# Altium project PT-15-V1.0.PrjPcb (part 7 of 7)

## Sheet 17-INTERFACE.SchDoc: KARGOBOT-TBOX-V2.0
size 513 x 386 mm; Page Create Date: March  8, 1995; Page Number: 4; Page Size: C; Page Count: 81; RevCode: A; DsnPath: C:\Users\Administrator\Desktop\123\KARGOBOT-TCU-ORIN-V1.1.DSN; SchematicName: KARGOBT-TCU-ORIN-V1.1; PageName: N100; PageSize: C; TopSchematic: True
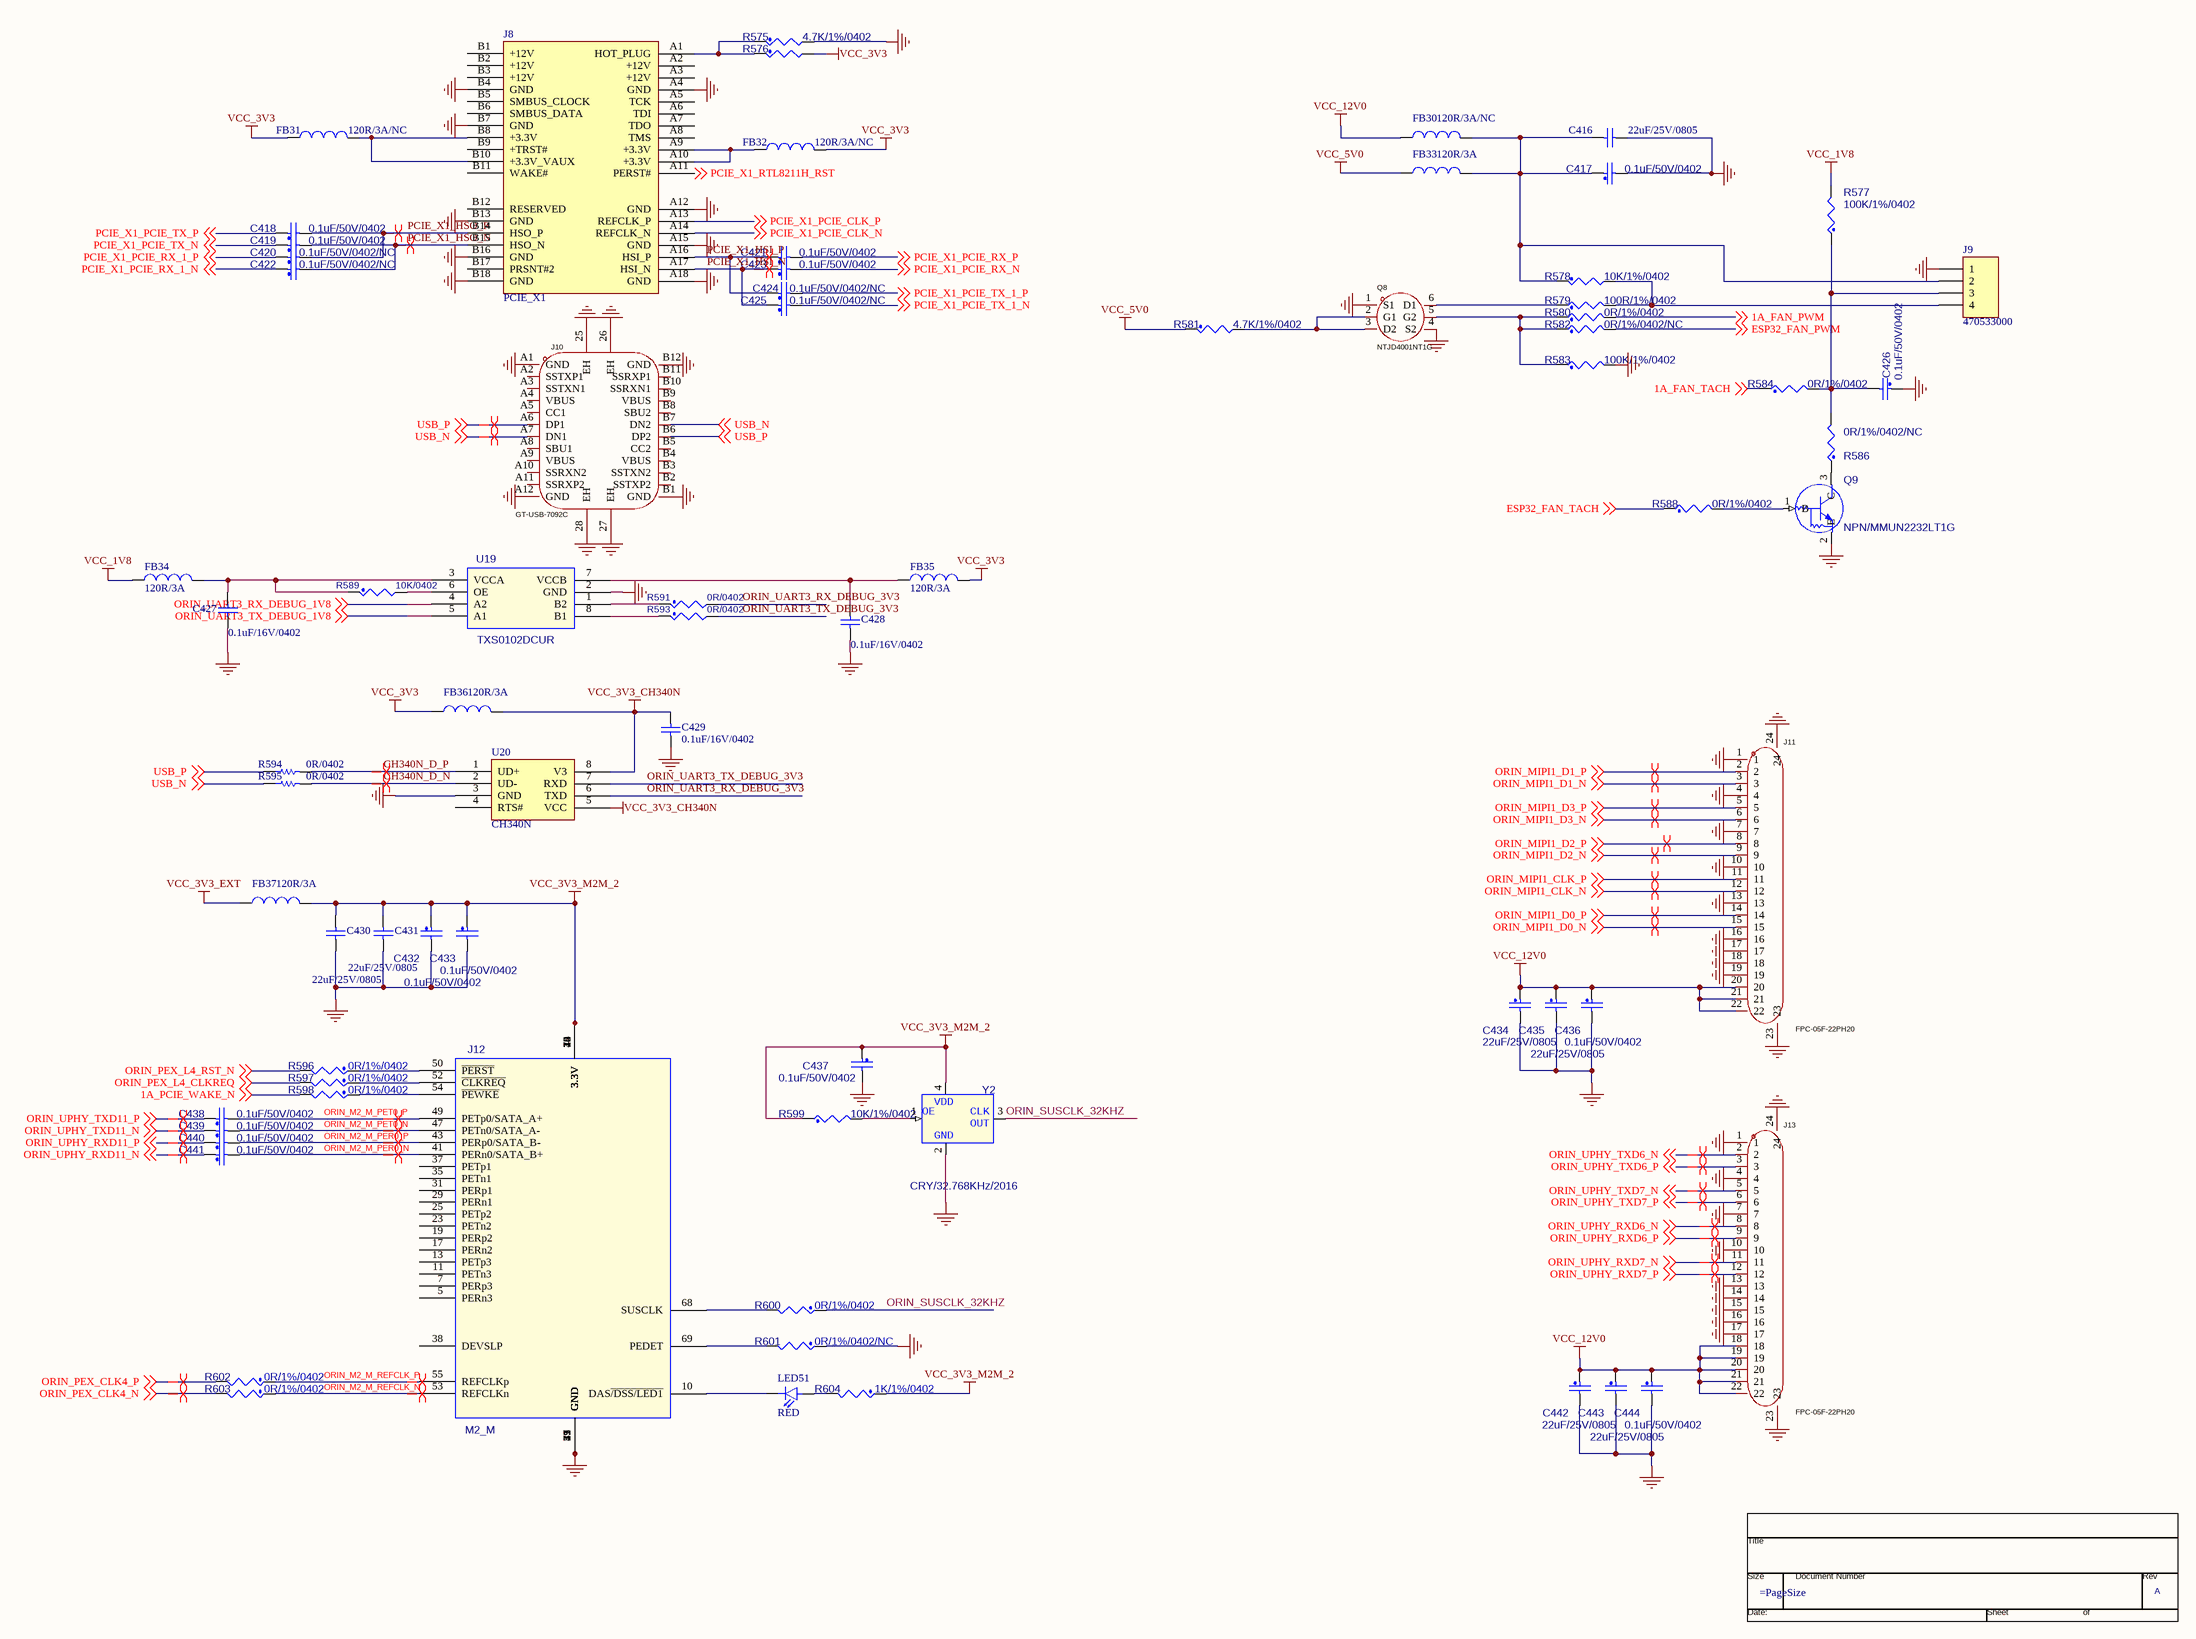
[diagram p27: 17-INTERFACE.SchDoc]

### Parts
(Parts that share a designator on the sheet are numbered #1, #2 ... from top to bottom, then left to right.)
*#12  RevCode: A  (graphical)
C416  22uF/25V/0805  [C0805]
C417  value 0.1uF/50V/0402  [C0402]  (hidden comment: CAP_NP)
C418  value 0.1uF/50V/0402  [C0402]  (hidden comment: CAP_NP)
C419  value 0.1uF/50V/0402  [C0402]  (hidden comment: CAP_NP)
C420  value 0.1uF/50V/0402/NC  [C0402]  (hidden comment: CAP_NP)
C421  value 0.1uF/50V/0402  [C0402]  (hidden comment: CAP_NP)
C422  value 0.1uF/50V/0402/NC  [C0402]  (hidden comment: CAP_NP)
C423  value 0.1uF/50V/0402  [C0402]  (hidden comment: CAP_NP)
C424  value 0.1uF/50V/0402/NC  [C0402]  (hidden comment: CAP_NP)
C425  value 0.1uF/50V/0402/NC  [C0402]  (hidden comment: CAP_NP)
C426  value 0.1uF/50V/0402  [C0402]  (hidden comment: CAP_NP)
C427  0.1uF/16V/0402  [C0402]
C428  0.1uF/16V/0402  [C0402]
C429  0.1uF/16V/0402  [C0402]
C430  22uF/25V/0805  [C0805]
C431  22uF/25V/0805  [C0805]
C432  value 0.1uF/50V/0402  [C0402]  (hidden comment: CAP_NP)
C433  value 0.1uF/50V/0402  [C0402]  (hidden comment: CAP_NP)
C434  value 22uF/25V/0805  [C0805]  (hidden comment: CAP_NP)
C435  value 22uF/25V/0805  [C0805]  (hidden comment: CAP_NP)
C436  value 0.1uF/50V/0402  [C0402]  (hidden comment: CAP_NP)
C437  0.1uF/50V/0402  [C0402]
C438  value 0.1uF/50V/0402  [C0402]  (hidden comment: CAP_NP)
C439  value 0.1uF/50V/0402  [C0402]  (hidden comment: CAP_NP)
C440  value 0.1uF/50V/0402  [C0402]  (hidden comment: CAP_NP)
C441  value 0.1uF/50V/0402  [C0402]  (hidden comment: CAP_NP)
C442  value 22uF/25V/0805  [C0805]  (hidden comment: CAP_NP)
C443  value 22uF/25V/0805  [C0805]  (hidden comment: CAP_NP)
C444  value 0.1uF/50V/0402  [C0402]  (hidden comment: CAP_NP)
FB30  120R/3A/NC  [L0603]
FB31  120R/3A/NC  [L0603]
FB32  120R/3A/NC  [L0603]
FB33  120R/3A  [L0603]
FB34  120R/3A  [L0603]
FB35  120R/3A  [L0603]
FB36  120R/3A  [L0603]
FB37  120R/3A  [L0603]
J8  PCIE_X1  [PCIeX16-GF-2D-1000-1K-O36]
J9  470533000  [470533000]
J10  GT-USB-7092C  [USB-C-SMD_GT-USB-7092C]
J11  FPC-05F-22PH20  [FPC-SMD_22P-P0.50_FPC-05F-22PH20]
J12  M2_M  [PCIe_M.2_Connectors_P=0.5mm_H=4.2mm_KeyM - 1]
J13  FPC-05F-22PH20  [FPC-SMD_22P-P0.50_FPC-05F-22PH20]
LED51  RED  [LED0603]
Q8  NTJD4001NT1G  [SOT-363_L2.0-W1.3-P0.65-LS2.1-TL]
Q9  NPN/MMUN2232LT1G  [SOT-23]
R575  value 4.7K/1%/0402  [R0402]  (hidden comment: RES_Dup2)
R576  RES_Dup2  [R0402]  (value not drawn)
R577  value 100K/1%/0402  [R0402]  (hidden comment: RES_Dup2)
R578  value 10K/1%/0402  [R0402]  (hidden comment: RES_Dup2)
R579  value 100R/1%/0402  [R0402]  (hidden comment: RES_Dup2)
R580  value 0R/1%/0402  [R0402]  (hidden comment: RES_Dup2)
R581  value 4.7K/1%/0402  [R0402]  (hidden comment: RES_Dup2)
R582  value 0R/1%/0402/NC  [R0402]  (hidden comment: RES_Dup2)
R583  value 100K/1%/0402  [R0402]  (hidden comment: RES_Dup2)
R584  value 0R/1%/0402  [R0402]  (hidden comment: RES_Dup2)
R586  value 0R/1%/0402/NC  [R0402]  (hidden comment: RES_Dup2)
R588  value 0R/1%/0402  [R0402]  (hidden comment: RES_Dup2)
R589  10K/0402  [R0402]
R591  0R/0402  [R0402]
R593  0R/0402  [R0402]
R594  0R/0402  [R0402]
R595  0R/0402  [R0402]
R596  value 0R/1%/0402  [R0402]  (hidden comment: RES_Dup2)
R597  value 0R/1%/0402  [R0402]  (hidden comment: RES_Dup2)
R598  value 0R/1%/0402  [R0402]  (hidden comment: RES_Dup2)
R599  10K/1%/0402  [R0402]
R600  value 0R/1%/0402  [R0402]  (hidden comment: RES_Dup2)
R601  value 0R/1%/0402/NC  [R0402]  (hidden comment: RES_Dup2)
R602  value 0R/1%/0402  [R0402]  (hidden comment: RES_Dup2)
R603  value 0R/1%/0402  [R0402]  (hidden comment: RES_Dup2)
R604  value 1K/1%/0402  [R0402]  (hidden comment: RES_Dup2)
U19  TXS0102DCUR  [VSSOP-8-TXS0102DCUR]
U20  CH340N  [SOP-8_L4.9-W3.9-P1.27-LS6.0-BL]
Y2  CRY/32.768KHz/2016  [CRY2016]

### Nets
GND: C416.1 C417.2 C426.1 C427.1 C428.1 C429.1 C430.1 C431.1 C432.2 C433.2 C434.2 C435.2 C436.2 C437.2 C442.2 C443.2 C444.2 J8.A4(GND) J8.A12(GND) J8.A15(GND) J8.A18(GND) J8.B4(GND) J8.B7(GND) J8.B13(GND) J8.B16(GND) J8.B18(GND) J9.1 J10.25(EH) J10.26(EH) J10.27(EH) J10.28(EH) J10.A1(GND) J10.A12(GND) J10.B1(GND) J10.B12(GND) J11.1 J11.4 J11.7 J11.10 J11.13 J11.16 J11.17 J11.18 J11.19 J11.23 J11.24 J12.1(GND) J12.3(GND) J12.9(GND) J12.15(GND) J12.21(GND) J12.27(GND) J12.33(GND) J12.39(GND) J12.45(GND) J12.51(GND) J12.57(GND) J12.71(GND) J12.73(GND) J12.75(GND) J13.1 J13.4 J13.7 J13.10 J13.13 J13.14 J13.15 J13.16 J13.17 J13.23 J13.24 Q8.1(S1) Q8.4(S2) Q9.2(E) R575.2 R583.2 R601.1 U19.2(GND) U20.3(GND) Y2.2(GND)
VCC_1V8: FB34.1 R577.2  [project net 1V8_ORIN_F1]
VCC_3V3: FB31.1 FB32.2 FB35.2 FB36.1 R576.2  [project net 3V3_ORIN_F1]
VCC_3V3_CH340N: C429.2 FB36.2 U20.5(VCC) U20.8(V3)
VCC_3V3_EXT: FB37.1
VCC_3V3_M2M_2: C430.2 C431.2 C432.1 C433.1 C437.1 FB37.2 J12.2(3.3V) J12.4(3.3V) J12.12(3.3V) J12.14(3.3V) J12.16(3.3V) J12.18(3.3V) J12.70(3.3V) J12.72(3.3V) J12.74(3.3V) R599.1 R604.1 Y2.4(VDD)
VCC_5V0: FB33.1 R581.1
VCC_12V0: C434.1 C435.1 C436.1 C442.1 C443.1 C444.1 FB30.1 J11.20 J11.21 J11.22 J13.18 J13.19 J13.20 J13.21 J13.22
1A_FAN_PWM: R580.2 ; off-sheet 1A_FAN_PWM  [project net FAN_PWM]
1A_FAN_TACH: R584.1 ; off-sheet 1A_FAN_TACH  [project net FAN_TACH]
1A_PCIE_WAKE_N: R598.2 ; off-sheet 1A_PCIE_WAKE_N  [project net PEX_WAKE_N]
CH340N_D_N: R595.2 U20.2(UD-)
CH340N_D_P: R594.2 U20.1(UD+)
ESP32_FAN_PWM: R582.2 ; off-sheet ESP32_FAN_PWM
ESP32_FAN_TACH: R588.1 ; off-sheet ESP32_FAN_TACH
ORIN_M2_M_PER0_N: C441.2 J12.41(PERn0/SATA_B+)
ORIN_M2_M_PER0_P: C440.2 J12.43(PERp0/SATA_B-)
ORIN_M2_M_PET0_N: C439.2 J12.47(PETn0/SATA_A-)
ORIN_M2_M_PET0_P: C438.2 J12.49(PETp0/SATA_A+)
ORIN_M2_M_REFCLK_N: J12.53(REFCLKn) R603.1
ORIN_M2_M_REFCLK_P: J12.55(REFCLKp) R602.1
ORIN_MIPI1_CLK_N: J11.12 ; off-sheet ORIN_MIPI1_CLK_N  [project net CSI_0_CLK_N]
ORIN_MIPI1_CLK_P: J11.11 ; off-sheet ORIN_MIPI1_CLK_P  [project net CSI_0_CLK_P]
ORIN_MIPI1_D0_N: J11.15 ; off-sheet ORIN_MIPI1_D0_N  [project net CSI_0_D0_N]
ORIN_MIPI1_D0_P: J11.14 ; off-sheet ORIN_MIPI1_D0_P  [project net CSI_0_D0_P]
ORIN_MIPI1_D1_N: J11.3 ; off-sheet ORIN_MIPI1_D1_N  [project net CSI_0_D1_N]
ORIN_MIPI1_D1_P: J11.2 ; off-sheet ORIN_MIPI1_D1_P  [project net CSI_0_D1_P]
ORIN_MIPI1_D2_N: J11.9 ; off-sheet ORIN_MIPI1_D2_N  [project net CSI_1_D0_N]
ORIN_MIPI1_D2_P: J11.8 ; off-sheet ORIN_MIPI1_D2_P  [project net CSI_1_D0_P]
ORIN_MIPI1_D3_N: J11.6 ; off-sheet ORIN_MIPI1_D3_N  [project net CSI_1_D1_N]
ORIN_MIPI1_D3_P: J11.5 ; off-sheet ORIN_MIPI1_D3_P  [project net CSI_1_D1_P]
ORIN_PEX_CLK4_N: R603.2 ; off-sheet ORIN_PEX_CLK4_N
ORIN_PEX_CLK4_P: R602.2 ; off-sheet ORIN_PEX_CLK4_P
ORIN_PEX_L4_CLKREQ: R597.2 ; off-sheet ORIN_PEX_L4_CLKREQ  [project net SNN_PEX_L4_CLKREQ_N]
ORIN_PEX_L4_RST_N: R596.2 ; off-sheet ORIN_PEX_L4_RST_N  [project net SNN_PEX_L4_RST_N]
ORIN_SUSCLK_32KHZ: R600.1 Y2.3(CLKOUT)
ORIN_UART3_RX_DEBUG_1V8: U19.4(A2) ; off-sheet ORIN_UART3_RX_DEBUG_1V8  [project net UART3_RX_DEBUG]
ORIN_UART3_RX_DEBUG_3V3: R591.2 U20.6(TXD)
ORIN_UART3_TX_DEBUG_1V8: U19.5(A1) ; off-sheet ORIN_UART3_TX_DEBUG_1V8  [project net UART3_TX_DEBUG]
ORIN_UART3_TX_DEBUG_3V3: R593.2 U20.7(RXD)
ORIN_UPHY_RXD6_N: J13.8 ; off-sheet ORIN_UPHY_RXD6_N  [project net UPHY_RX6_N]
ORIN_UPHY_RXD6_P: J13.9 ; off-sheet ORIN_UPHY_RXD6_P  [project net UPHY_RX6_P]
ORIN_UPHY_RXD7_N: J13.11 ; off-sheet ORIN_UPHY_RXD7_N  [project net UPHY_RX7_N]
ORIN_UPHY_RXD7_P: J13.12 ; off-sheet ORIN_UPHY_RXD7_P  [project net UPHY_RX7_P]
ORIN_UPHY_RXD11_N: C441.1 ; off-sheet ORIN_UPHY_RXD11_N  [project net UPHY_RX11_N]
ORIN_UPHY_RXD11_P: C440.1 ; off-sheet ORIN_UPHY_RXD11_P  [project net UPHY_RX11_P]
ORIN_UPHY_TXD6_N: J13.2 ; off-sheet ORIN_UPHY_TXD6_N
ORIN_UPHY_TXD6_P: J13.3 ; off-sheet ORIN_UPHY_TXD6_P
ORIN_UPHY_TXD7_N: J13.5 ; off-sheet ORIN_UPHY_TXD7_N
ORIN_UPHY_TXD7_P: J13.6 ; off-sheet ORIN_UPHY_TXD7_P
ORIN_UPHY_TXD11_N: C439.1 ; off-sheet ORIN_UPHY_TXD11_N  [project net UPHY_TX11_N]
ORIN_UPHY_TXD11_P: C438.1 ; off-sheet ORIN_UPHY_TXD11_P  [project net UPHY_TX11_P]
PCIE_X1_HSI_N: C423.1 C425.1 J8.A17(HSI_N)
PCIE_X1_HSI_P: C421.1 C424.1 J8.A16(HSI_P)
PCIE_X1_HSO_N: C419.2 C422.2 J8.B15(HSO_N)
PCIE_X1_HSO_P: C418.2 C420.2 J8.B14(HSO_P)
PCIE_X1_PCIE_CLK_N: J8.A14(REFCLK_N) ; off-sheet PCIE_X1_PCIE_CLK_N
PCIE_X1_PCIE_CLK_P: J8.A13(REFCLK_P) ; off-sheet PCIE_X1_PCIE_CLK_P
PCIE_X1_PCIE_RX_1_N: C422.1 ; off-sheet PCIE_X1_PCIE_RX_1_N
PCIE_X1_PCIE_RX_1_P: C420.1 ; off-sheet PCIE_X1_PCIE_RX_1_P
PCIE_X1_PCIE_RX_N: C423.2 ; off-sheet PCIE_X1_PCIE_RX_N
PCIE_X1_PCIE_RX_P: C421.2 ; off-sheet PCIE_X1_PCIE_RX_P
PCIE_X1_PCIE_TX_1_N: C425.2 ; off-sheet PCIE_X1_PCIE_TX_1_N
PCIE_X1_PCIE_TX_1_P: C424.2 ; off-sheet PCIE_X1_PCIE_TX_1_P
PCIE_X1_PCIE_TX_N: C419.1 ; off-sheet PCIE_X1_PCIE_TX_N
PCIE_X1_PCIE_TX_P: C418.1 ; off-sheet PCIE_X1_PCIE_TX_P
PCIE_X1_RTL8211H_RST: J8.A11(PERST#) ; off-sheet PCIE_X1_RTL8211H_RST
USB_N: J10.A7(DN1) J10.B7(DN2) R595.1 ; off-sheet USB_N
USB_P: J10.A6(DP1) J10.B6(DP2) R594.1 ; off-sheet USB_P
NetC416_2: C416.2 C417.1 FB30.2 FB33.2 J9.2 R578.1
NetC426_2: C426.2 J9.3 R577.1 R584.2 R586.2
NetC427_2: C427.2 FB34.2 R589.1 U19.3(VCCA)
NetC428_2: C428.2 FB35.1 U19.7(VCCB)
NetFB31_2: FB31.2 J8.B8(+3.3V) J8.B10(+3.3V_VAUX)
NetFB32_1: FB32.1 J8.A9(+3.3V) J8.A10(+3.3V)
NetJ8_A1: J8.A1(HOT_PLUG) R575.1 R576.1
NetJ9_4: J9.4 R578.2 R579.2
NetJ12_10: J12.10(DAS~{/DSS/LED1}) LED51.2
NetJ12_50: J12.50(~{PERST}) R596.1
NetJ12_52: J12.52(~{CLKREQ}) R597.1
NetJ12_54: J12.54(~{PEWKE}) R598.1
NetJ12_68: J12.68(SUSCLK) R600.2
NetJ12_69: J12.69(PEDET) R601.2
NetLED51_1: LED51.1 R604.2
NetQ8_2: Q8.2(G1) Q8.3(D2) R581.2
NetQ8_5: Q8.5(G2) R580.1 R582.1 R583.1
NetQ8_6: Q8.6(D1) R579.1
NetQ9_1: Q9.1(B) R588.2
NetQ9_3: Q9.3(C) R586.1
NetR589_2: R589.2 U19.6(OE)
NetR591_1: R591.1 U19.1(B2)
NetR593_1: R593.1 U19.8(B1)
NetR599_2: R599.2 Y2.1(OE)

Not connected (* = marked no-connect by the designer): J8 A2(+12V) A3(+12V) A5(TCK) A6(TDI) A7(TDO) A8(TMS) B1(+12V) B2(+12V) B3(+12V) B5(SMBUS_CLOCK) B6(SMBUS_DATA) B9(+TRST#) B11(WAKE#) B12(RESERVED) B17(PRSNT#2); J10 A2(SSTXP1) A3(SSTXN1) A4(VBUS) A5(CC1) A8(SBU1) A9(VBUS) A10(SSRXN2) A11(SSRXP2) B2(SSTXP2) B3(SSTXN2) B4(VBUS) B5(CC2) B8(SBU2) B9(VBUS) B10(SSRXN1) B11(SSRXP1); J12 5(PERn3) 7(PERp3) 11(PETn3) 13(PETp3) 17(PERn2) 19(PERp2) 23(PETn2) 25(PETp2) 29(PERn1) 31(PERp1) 35(PETn1) 37(PETp1) 38(DEVSLP); U20 4(RTS#)

### Layout directives
differential pair: CH340N_D_N, CH340N_D_P, CSI_0_CLK_N, CSI_0_CLK_P, CSI_0_D0_N, CSI_0_D0_P, CSI_0_D1_N, CSI_0_D1_P, CSI_1_D0_N, CSI_1_D0_P, CSI_1_D1_N, CSI_1_D1_P, ORIN_M2_M_PER0_N, ORIN_M2_M_PER0_P, ORIN_M2_M_PET0_N, ORIN_M2_M_PET0_P, ORIN_M2_M_REFCLK_N, ORIN_M2_M_REFCLK_P, ORIN_PEX_CLK4_N, ORIN_PEX_CLK4_P, ORIN_UPHY_TXD6_N, ORIN_UPHY_TXD6_P, ORIN_UPHY_TXD7_N, ORIN_UPHY_TXD7_P, PCIE_X1_HSI_N, PCIE_X1_HSI_P, PCIE_X1_HSO_N, PCIE_X1_HSO_P, UPHY_RX6_N, UPHY_RX6_P, UPHY_RX7_N, UPHY_RX7_P, UPHY_RX11_N, UPHY_RX11_P, UPHY_TX11_N, UPHY_TX11_P, USB_N, USB_P

### Notes on the sheet
- (in symbol CLKGEN-SM) CLK; OUT
- (in symbol TitleBlock0) Title; Size; Document Number; Rev; Date:; Sheet; of

### Library data of the parts
*#12 = TitleBlock0: Page Count: 81; Page Number: 4; Title: KARGOBOT-TBOX-V2.0; Page Size: =PageSize; Page Create Date: March  8, 1995; Page Modify Date: =ModifiedDate
C416 C427-C431 = CAP: Capacitor; Value: 100pF; Published: 8-Jun-2000; Revision: July-2002: Re-released for DXP Platform.; Publisher: Altium Limited
C417-C426 C432 C433 C436 C438-C441 C444 = CAP_NP: GCM155R71H104KE02/MURATA; Part Reference: C15; CLASS: DISCRETE; FPLIST: CC0402_25,CC0402_HD,CC0402_CC; CAD_APPROVED: Yes; MFG_PN01: 0402YC104KAT2A; MFG_NAME01: AVX; Tolerance: 10%; AGILE_PN: 150-75182; VOLTAGE: 16V; HEIGHT: 0.635MM; ROHS: Yes; TOL: 10%; PCB Footprint: C0402
C434 C435 C442 C443 = CAP_NP: GRT31CC71E226ME13/MURATA; Part Reference: C13; CLASS: DISCRETE; VOLTAGE: 10v; CAD_APPROVED: Yes; MFG_PN01: C1608X5R1A106K; MFG_NAME01: TDK; TOL: 10%; AGILE_PN: 150-78675; FPLIST: CC0603_OV,CC0603,0603_CC; PCB Footprint: C1206; HEIGHT: 1.016MM; ROHS: Yes; Tolerance: 10%
C437 = CAP_NP_Dup1: GCM155R71H104KE02/MURATA; Part Reference: C38; CLASS: DISCRETE; Value: 0.1uF/50V/0402; PCB Footprint: C0402
FB30-FB37 = Inductor: BLM18KG121TN1D; Code_IEC: 1005; Value: 10mH; Published: 8-Jun-2000; LatestRevisionDate: 29-May-2009; LatestRevisionNote: IPC-7351 Footprint Added.; PackageReference: 0402-A; Publisher: Altium Limited; PackageDescription: Chip Inductor; Code_JEITA: 0402
J9 = Header 4: Header, 4-Pin; LatestRevisionDate: 17-Jul-2002; LatestRevisionNote: Re-released for DXP Platform.; Publisher: Altium Limited
J10 = GT-USB-7092C: Manufacturer: G-Switch(品赞); Add into BOM: yes; Connector Type: Type-C; Gender: 母; Number of Contacts: 24P; Number of Ports: 1; Current Rating - Power (Max): 5A; Rated Voltage (Max): 24V; Connect-Disconnect Life: 1万次; Center Height: 7.2mm; Core Colour: 黑色; Symbol: GT-USB-7092C; Device: GT-USB-7092C; LCSC Part Name: Type-C 母 侧贴; Supplier Part: C22471968; Manufacturer Part: GT-USB-7092C; Supplier Footprint: SMD; JLCPCB Part Class: Extended Part; Datasheet: https://atta.szlcsc.com/upload/public/pdf/source/20240624/0752ADA6134B10077FCDD9A2DA872EFC.pdf; Supplier: LCSC; Convert to PCB: yes; Standard: USB 3.1; Mounting Style: 侧贴; Length: 13.9mm; Operating Temperature Range: -40℃~+85℃; Comment_1: GT-USB-7092C
J11 J13 = FPC-05F-22PH20: Manufacturer: XUNPU(讯普); Add into BOM: yes; Locking Feature: 翻盖式; Number of Contacts: 22P; Pitch: 0.5mm; FFC, FCB Thickness: 0.3mm; Symbol: FPC-05F-22PH20; Device: FPC-05F-22PH20; LCSC Part Name: 间距:0.5mm P数:22P 翻盖式 下接; Supplier Part: C2856804; Manufacturer Part: FPC-05F-22PH20; Supplier Footprint: SMD,P=0.5mm,卧贴; JLCPCB Part Class: Extended Part; Datasheet: https://atta.szlcsc.com/upload/public/pdf/source/20210922/C2856804_675295370E4BEA18823604D875A4450B.pdf; Supplier: LCSC; Convert to PCB: yes; Contact Type: 下接; Mounting Type: 卧贴; Height Above Board: 2mm; Operating Temperature Range: -25℃~+85℃; Comment_1: FPC-05F-22PH20
J12 = M2_M: Part Reference: J2; PCB Footprint: M2_M; Value: M2_M
LED51 = LED
Q8 = NTJD4001NT1G: Manufacturer: onsemi(安森美); Add into BOM: yes; Type: 2个N沟道; Drain Source Voltage (Vdss): 30V; Continuous Drain Current (Id): 250mA; Drain Source On Resistance (RDS(on)@Vgs,Id): 1Ω@4.0V,10mA; Power Dissipation (Pd): 272mW; Gate Threshold Voltage (Vgs(th)@Id): 1.2V@100uA; Total Gate Charge (Qg@Vgs): 1.3nC@5.0V; Input Capacitance (Ciss@Vds): 33pF; Reverse Transfer Capacitance (Crss@Vds): 12pF; Symbol: NTJD4001NT1G; Device: NTJD4001NT1G; LCSC Part Name: 2个N沟道 耐压:30V 电流:250mA; Supplier Part: C190019; Manufacturer Part: NTJD4001NT1G; Supplier Footprint: SOT-363; JLCPCB Part Class: Extended Part; Datasheet: https://atta.szlcsc.com/upload/public/pdf/source/20221020/BF1533DEA35874F4C3E9C060B4E2CFE5.pdf; Supplier: LCSC; Convert to PCB: yes; Operating Temperature: -55℃~+150℃; Comment_1: NTJD4001NT1G
Q9 = DTC143ZE: MMUN2232LT1G/ONSEMI; Part Reference: Q1; Value: NPN/MMUN2232LT1G; PCB Footprint: SOT-23
R575 R576 R578 R581 = RES_Dup2: AC0402FR-074K7L/YAGEO; Part Reference: R7982; CLASS: DISCRETE; TOL: 5%; AGILE_PN: 470-75626; MFG_NAME01: KOA SPEER; MFG_PN01: RK73B1ETTP472J; CAD_APPROVED: Yes; FPLIST: RC0402_25,RC0402_HD,RC0402_CC; HEIGHT: 0.41mm; Tolerance: 5%; ROHS: Yes; PCB Footprint: R0402
R577 R579 R580 R582-R584 R586 R588 = RES_Dup2: AC0402FR-070RL/YAGEO; Part Reference: R179; CLASS: DISCRETE; SIGNAL_MODEL: DEFAULT_RESISTOR_33.000000OHM_2_1; FPLIST: RC0603_OV; CAD_APPROVED: Yes; MFG_PN01: CR-02FL6---33R; MFG_NAME01: YAGEO; Tolerance: 1%; AGILE_PN: 470-75790; TOL: 5%; ROHS: Yes; HEIGHT: 0.4MM; PCB Footprint: R0402
R589 R591 R593 = RES_Dup1: RES MF 1.0K 1/16W 5% 0402; CLASS: DISCRETE; AGILE_PN: 470-75555; MFG_NAME01: VISHAY INTERTECHNOLOGY; MFG_PN01: CRCW04021K00JNED; CAD_APPROVED: Yes; FPLIST: RC0402_25,RC0402_HD,RC0402_CC; HEIGHT: 0.41mm; TOL: 5%; Tolerance: 5%; ROHS: Yes
R594 R595 = Res Semi: Semiconductor Resistor; Value: 240R; Published: 8-Jun-2000; LatestRevisionDate: 17-Jul-2002; LatestRevisionNote: Re-released for DXP Platform.; PackageReference: AXIAL-0.5; Publisher: Altium Limited; PackageDescription: Axial Device, Thru-Hole; 2 Leads; 0.5 in Pin Spacing
R596-R598 R600-R604 = RES_Dup2: AC0402FR-070RL/YAGEO; Part Reference: R97; CLASS: DISCRETE; SIGNAL_MODEL: DEFAULT_RESISTOR_33.000000OHM_2_1; FPLIST: RC0603_OV; CAD_APPROVED: Yes; MFG_PN01: CR-02FL6---33R; MFG_NAME01: YAGEO; Tolerance: 1%; AGILE_PN: 470-75790; TOL: 5%; ROHS: Yes; HEIGHT: 0.4MM; PCB Footprint: R0402
R599 = RES_0: AC0402FR-0710KL/YAGEO; Part Reference: R55; CLASS: DISCRETE; Value: 10K/1%/0402; PCB Footprint: R0402
U19 = TXS0102DCUR: TXS0102DCUR/TI; Part Reference: U12; PCB Footprint: VSSOP8-TXS0102DCUR; Value: TXS0102DCUR
Y2 = CLKGEN-SM: SX1M32.768KM10F30TNN/SCTF; Part Reference: Y1; CLASS: IC; Value: CRY/32.768KHz/2016; PCB Footprint: CRY2016

## Nets that join several sheets
1V8_ORIN_F1: 01-ORIN_PWR (R1.2), 02-ORIN_LOW_SPEED_SIGNAL (29 pins), 03-ORIN_HIGH_SPEED_SIGNAL_1 (R129.2 R130.2), 04-ORIN_HIGH_SPEED_SIGNAL_2 (14 pins), 05_RTL8211F (L4.1), 16-PWR_2 (FB21.2 FB22.2), 17-INTERFACE (FB34.1 R577.2)
3V3_ORIN_F1: 02-ORIN_LOW_SPEED_SIGNAL (R114.2), 03-ORIN_HIGH_SPEED_SIGNAL_1 (FB1.1), 04-ORIN_HIGH_SPEED_SIGNAL_2 (6 pins), 05_RTL8211F (9 pins), 06-RTL8111H-1 (FB4.1), 07-N100 (5 pins), 09-RTL8111H-2 (FB9.1), 10-ESP32 (FB10.1 FB11.2 FB13.1 R308.1), 12-RTL8111H-3 (FB14.1), 13-AX88179A (L7.1), 14-RTL8367 (FB16.1), 16-PWR_2 (FB17.2 FB18.2 R553.1), 17-INTERFACE (5 pins)
GND: 01-ORIN_PWR (285 pins), 02-ORIN_LOW_SPEED_SIGNAL (8 pins), 03-ORIN_HIGH_SPEED_SIGNAL_1 (C40.2 C41.2 J16.2), 04-ORIN_HIGH_SPEED_SIGNAL_2 (11 pins), 05_RTL8211F (26 pins), 06-RTL8111H-1 (16 pins), 07-N100 (80 pins), 08-M2_E&M_KEY (36 pins), 09-RTL8111H-2 (16 pins), 10-ESP32 (61 pins), 11-LED (53 pins), 12-RTL8111H-3 (16 pins), 13-AX88179A (47 pins), 14-RTL8367 (71 pins), 15-PWR_1 (91 pins), 16-PWR_2 (71 pins), 17-INTERFACE (80 pins)
VCC_3V3_EXT: 08-M2_E&M_KEY (FB7.1 FB8.1), 16-PWR_2 (FB19.2 FB20.2 R559.1), 17-INTERFACE (FB37.1)
VCC_3V3_LED: 11-LED (53 pins), 16-PWR_2 (FB23.2 FB24.2 R570.1)
VCC_5V0: 01-ORIN_PWR (17 pins), 13-AX88179A (FB38.1), 15-PWR_1 (8 pins), 16-PWR_2 (18 pins), 17-INTERFACE (FB33.1 R581.1)
VCC_12V0: 01-ORIN_PWR (62 pins), 07-N100 (16 pins), 15-PWR_1 (8 pins), 17-INTERFACE (15 pins)
VCCIN: 15-PWR_1 (27 pins), 16-PWR_2 (6 pins)
VCCIN_12V: 10-ESP32 (R630.2), 15-PWR_1 (7 pins)
VCCIN_VBUS_20V: 10-ESP32 (R629.2), 15-PWR_1 (12 pins)
8211_MDC: 02-ORIN_LOW_SPEED_SIGNAL (R56.1), 05_RTL8211F (R232.1)
8211_MDIO: 02-ORIN_LOW_SPEED_SIGNAL (R55.1), 05_RTL8211F (R240.1)
8211_RESET: 02-ORIN_LOW_SPEED_SIGNAL (B1.H5 R57.1), 05_RTL8211F (R230.1)
AX88179A_MDI0_N: 13-AX88179A (R373.1), 14-RTL8367 (C216.2 R397.2)
AX88179A_MDI0_P: 13-AX88179A (R374.1), 14-RTL8367 (C222.2 R401.2)
AX88179A_MDI1_N: 13-AX88179A (R371.1), 14-RTL8367 (C224.2 R405.2)
AX88179A_MDI1_P: 13-AX88179A (R372.1), 14-RTL8367 (C230.2 R409.2)
AX88179A_MDI2_N: 13-AX88179A (R369.1), 14-RTL8367 (C232.2 R413.2)
AX88179A_MDI2_P: 13-AX88179A (R370.1), 14-RTL8367 (C238.2 R417.2)
AX88179A_MDI3_N: 13-AX88179A (R367.1), 14-RTL8367 (C240.2 R421.2)
AX88179A_MDI3_P: 13-AX88179A (R368.1), 14-RTL8367 (C246.2 R425.2)
CSI_0_CLK_N: 03-ORIN_HIGH_SPEED_SIGNAL_1 (B1.F42), 17-INTERFACE (J11.12)
CSI_0_CLK_P: 03-ORIN_HIGH_SPEED_SIGNAL_1 (B1.F43), 17-INTERFACE (J11.11)
CSI_0_D0_N: 03-ORIN_HIGH_SPEED_SIGNAL_1 (B1.E41), 17-INTERFACE (J11.15)
CSI_0_D0_P: 03-ORIN_HIGH_SPEED_SIGNAL_1 (B1.E42), 17-INTERFACE (J11.14)
CSI_0_D1_N: 03-ORIN_HIGH_SPEED_SIGNAL_1 (B1.E38), 17-INTERFACE (J11.3)
CSI_0_D1_P: 03-ORIN_HIGH_SPEED_SIGNAL_1 (B1.E39), 17-INTERFACE (J11.2)
CSI_1_D0_N: 03-ORIN_HIGH_SPEED_SIGNAL_1 (B1.G42), 17-INTERFACE (J11.9)
CSI_1_D0_P: 03-ORIN_HIGH_SPEED_SIGNAL_1 (B1.G41), 17-INTERFACE (J11.8)
CSI_1_D1_N: 03-ORIN_HIGH_SPEED_SIGNAL_1 (B1.J42), 17-INTERFACE (J11.6)
CSI_1_D1_P: 03-ORIN_HIGH_SPEED_SIGNAL_1 (B1.J41), 17-INTERFACE (J11.5)
DP1_TXD2_N: 04-ORIN_HIGH_SPEED_SIGNAL_2 (B1.D48), 06-RTL8111H-1 (R257.2)
DP1_TXD2_P: 04-ORIN_HIGH_SPEED_SIGNAL_2 (B1.D49), 06-RTL8111H-1 (R256.2)
ESP32_FAN_PWM: 10-ESP32 (U6.34), 17-INTERFACE (R582.2)
ESP32_FAN_TACH: 10-ESP32 (U6.33), 17-INTERFACE (R588.1)
FAN_PWM: 02-ORIN_LOW_SPEED_SIGNAL (B1.K62), 17-INTERFACE (R580.2)
FAN_TACH: 02-ORIN_LOW_SPEED_SIGNAL (B1.E54 R109.2), 17-INTERFACE (R584.1)
N100_GBE_PCIE_CLK_N: 07-N100 (U4.96), 09-RTL8111H-2 (R301.2)
N100_GBE_PCIE_CLK_P: 07-N100 (U4.94), 09-RTL8111H-2 (R300.2)
N100_GBE_PCIE_RX_N: 07-N100 (U4.66), 09-RTL8111H-2 (C118.1)
N100_GBE_PCIE_RX_P: 07-N100 (U4.64), 09-RTL8111H-2 (C119.1)
N100_GBE_PCIE_TX_N: 07-N100 (U4.63), 09-RTL8111H-2 (C116.1)
N100_GBE_PCIE_TX_P: 07-N100 (U4.61), 09-RTL8111H-2 (C117.1)
N100_M2E_PCIE_CLK_N: 07-N100 (U4.90), 08-M2_E&M_KEY (R286.2)
N100_M2E_PCIE_CLK_P: 07-N100 (U4.88), 08-M2_E&M_KEY (R285.2)
N100_M2E_PCIE_RST: 07-N100 (U4.105), 08-M2_E&M_KEY (R269.2 R277.2), 09-RTL8111H-2 (R302.2)
N100_M2E_PCIE_RX_N: 07-N100 (U4.36), 08-M2_E&M_KEY (C106.1)
N100_M2E_PCIE_RX_P: 07-N100 (U4.34), 08-M2_E&M_KEY (C105.1)
N100_M2E_PCIE_TX_N: 07-N100 (U4.33), 08-M2_E&M_KEY (C104.1)
N100_M2E_PCIE_TX_P: 07-N100 (U4.31), 08-M2_E&M_KEY (C103.1)
N100_M2E_PCIE_WAKE: 07-N100 (U4.103), 08-M2_E&M_KEY (R271.2 R279.2)
N100_M2E_SUSCLK: 07-N100 (U4.131), 08-M2_E&M_KEY (R272.1 R284.1)
N100_M2E_USB_N: 07-N100 (U4.78), 08-M2_E&M_KEY (R283.2)
N100_M2E_USB_P: 07-N100 (U4.76), 08-M2_E&M_KEY (R282.2)
N100_M2M_PCIE_CLK_N: 07-N100 (U4.87), 08-M2_E&M_KEY (R275.2)
N100_M2M_PCIE_CLK_P: 07-N100 (U4.85), 08-M2_E&M_KEY (R274.2)
N100_M2M_PCIE_RX_N: 07-N100 (U4.30), 08-M2_E&M_KEY (C98.1)
N100_M2M_PCIE_RX_P: 07-N100 (U4.28), 08-M2_E&M_KEY (C97.1)
N100_M2M_PCIE_TX_N: 07-N100 (U4.27), 08-M2_E&M_KEY (C96.1)
N100_M2M_PCIE_TX_P: 07-N100 (U4.25), 08-M2_E&M_KEY (C95.1)
N100_PWRBTN: 07-N100 (R263.2 R264.2 U4.1), 10-ESP32 (R632.2)
N100_RSTBTN: 07-N100 (U4.3), 10-ESP32 (R310.1)
N100_RTL8111_MDI0_N: 09-RTL8111H-2 (R295.1), 14-RTL8367 (C248.2 R432.2)
N100_RTL8111_MDI0_P: 09-RTL8111H-2 (R296.1), 14-RTL8367 (C251.2 R434.2)
N100_RTL8111_MDI1_N: 09-RTL8111H-2 (R293.1), 14-RTL8367 (C252.2 R439.2)
N100_RTL8111_MDI1_P: 09-RTL8111H-2 (R294.1), 14-RTL8367 (C257.2 R441.2)
N100_RTL8111_MDI2_N: 09-RTL8111H-2 (R291.1), 14-RTL8367 (C258.2 R443.2)
N100_RTL8111_MDI2_P: 09-RTL8111H-2 (R292.1), 14-RTL8367 (C261.2 R445.2)
N100_RTL8111_MDI3_N: 09-RTL8111H-2 (R287.1), 14-RTL8367 (C262.2 R447.2)
N100_RTL8111_MDI3_P: 09-RTL8111H-2 (R290.1), 14-RTL8367 (C265.2 R449.2)
ORIN_FORCE_SHUTDOWN: 04-ORIN_HIGH_SPEED_SIGNAL_2 (Q10.1), 10-ESP32 (R318.2 R319.2 U6.15)
ORIN_PEX_CLK4_N: 04-ORIN_HIGH_SPEED_SIGNAL_2 (R155.2), 17-INTERFACE (R603.2)
ORIN_PEX_CLK4_P: 04-ORIN_HIGH_SPEED_SIGNAL_2 (R157.2), 17-INTERFACE (R602.2)
ORIN_RTL8111_MDI0_N: 05_RTL8211F (R208.1), 06-RTL8111H-1 (R251.1), 14-RTL8367 (C298.2 R489.2)
ORIN_RTL8111_MDI0_P: 05_RTL8211F (R207.1), 06-RTL8111H-1 (R252.1), 14-RTL8367 (C301.2 R491.2)
ORIN_RTL8111_MDI1_N: 05_RTL8211F (R211.1), 06-RTL8111H-1 (R249.1), 14-RTL8367 (C303.2 R493.2)
ORIN_RTL8111_MDI1_P: 05_RTL8211F (R209.1), 06-RTL8111H-1 (R250.1), 14-RTL8367 (C311.2 R495.2)
ORIN_RTL8111_MDI2_N: 05_RTL8211F (R213.1), 06-RTL8111H-1 (R247.1), 14-RTL8367 (C312.2 R497.2)
ORIN_RTL8111_MDI2_P: 05_RTL8211F (R212.1), 06-RTL8111H-1 (R248.1), 14-RTL8367 (C315.2 R499.2)
ORIN_RTL8111_MDI3_N: 05_RTL8211F (R215.1), 06-RTL8111H-1 (R243.1), 14-RTL8367 (C316.2 R501.2)
ORIN_RTL8111_MDI3_P: 05_RTL8211F (R214.1), 06-RTL8111H-1 (R246.1), 14-RTL8367 (C319.2 R503.2)
ORIN_UPHY_TXD6_N: 04-ORIN_HIGH_SPEED_SIGNAL_2 (C42.2), 17-INTERFACE (J13.2)
ORIN_UPHY_TXD6_P: 04-ORIN_HIGH_SPEED_SIGNAL_2 (C43.2), 17-INTERFACE (J13.3)
ORIN_UPHY_TXD7_N: 04-ORIN_HIGH_SPEED_SIGNAL_2 (C44.2), 17-INTERFACE (J13.5)
ORIN_UPHY_TXD7_P: 04-ORIN_HIGH_SPEED_SIGNAL_2 (C45.2), 17-INTERFACE (J13.6)
PCIE_X1_PCIE_CLK_N: 12-RTL8111H-3 (R354.2), 17-INTERFACE (J8.A14)
PCIE_X1_PCIE_CLK_P: 12-RTL8111H-3 (R353.2), 17-INTERFACE (J8.A13)
PCIE_X1_PCIE_RX_1_N: 12-RTL8111H-3 (C175.1), 17-INTERFACE (C422.1)
PCIE_X1_PCIE_RX_1_P: 12-RTL8111H-3 (C176.1), 17-INTERFACE (C420.1)
PCIE_X1_PCIE_RX_N: 12-RTL8111H-3 (C173.1), 17-INTERFACE (C423.2)
PCIE_X1_PCIE_RX_P: 12-RTL8111H-3 (C174.1), 17-INTERFACE (C421.2)
PCIE_X1_PCIE_TX_1_N: 12-RTL8111H-3 (C179.1), 17-INTERFACE (C425.2)
PCIE_X1_PCIE_TX_1_P: 12-RTL8111H-3 (C180.1), 17-INTERFACE (C424.2)
PCIE_X1_PCIE_TX_N: 12-RTL8111H-3 (C177.1), 17-INTERFACE (C419.1)
PCIE_X1_PCIE_TX_P: 12-RTL8111H-3 (C178.1), 17-INTERFACE (C418.1)
PCIE_X1_RTL8111_MDI0_N: 12-RTL8111H-3 (R348.1), 14-RTL8367 (C217.2 R399.2)
PCIE_X1_RTL8111_MDI0_P: 12-RTL8111H-3 (R349.1), 14-RTL8367 (C223.2 R403.2)
PCIE_X1_RTL8111_MDI1_N: 12-RTL8111H-3 (R346.1), 14-RTL8367 (C225.2 R407.2)
PCIE_X1_RTL8111_MDI1_P: 12-RTL8111H-3 (R347.1), 14-RTL8367 (C231.2 R411.2)
PCIE_X1_RTL8111_MDI2_N: 12-RTL8111H-3 (R344.1), 14-RTL8367 (C233.2 R415.2)
PCIE_X1_RTL8111_MDI2_P: 12-RTL8111H-3 (R345.1), 14-RTL8367 (C239.2 R419.2)
PCIE_X1_RTL8111_MDI3_N: 12-RTL8111H-3 (R340.1), 14-RTL8367 (C241.2 R423.2)
PCIE_X1_RTL8111_MDI3_P: 12-RTL8111H-3 (R343.1), 14-RTL8367 (C247.2 R427.2)
PCIE_X1_RTL8211H_RST: 12-RTL8111H-3 (R355.2), 17-INTERFACE (J8.A11)
PEX_WAKE_N: 04-ORIN_HIGH_SPEED_SIGNAL_2 (R166.2), 17-INTERFACE (R598.2)
PHYAD0: 02-ORIN_LOW_SPEED_SIGNAL (R40.1), 05_RTL8211F (R216.1 R217.1 U2.22)
PHYAD1: 02-ORIN_LOW_SPEED_SIGNAL (R35.1), 05_RTL8211F (R218.1 R219.1 U2.27)
PHYAD2: 02-ORIN_LOW_SPEED_SIGNAL (R42.1), 05_RTL8211F (R220.1 R221.1 U2.26)
PLLOFF: 02-ORIN_LOW_SPEED_SIGNAL (R38.1), 05_RTL8211F (R226.1 R227.1 U2.23)
RGMII_RD0: 02-ORIN_LOW_SPEED_SIGNAL (R45.1), 05_RTL8211F (U2.18)
RGMII_RD1: 02-ORIN_LOW_SPEED_SIGNAL (R46.1), 05_RTL8211F (U2.17)
RGMII_RD2: 02-ORIN_LOW_SPEED_SIGNAL (R48.1), 05_RTL8211F (U2.16)
RGMII_RD3: 02-ORIN_LOW_SPEED_SIGNAL (R49.1), 05_RTL8211F (U2.15)
RGMII_RX_CTL: 02-ORIN_LOW_SPEED_SIGNAL (R51.1), 05_RTL8211F (U2.19)
RGMII_RXC: 02-ORIN_LOW_SPEED_SIGNAL (R43.1), 05_RTL8211F (U2.20)
RGMII_TD0: 02-ORIN_LOW_SPEED_SIGNAL (R36.1), 05_RTL8211F (R222.1 R223.1 U2.25)
RGMII_TD1: 02-ORIN_LOW_SPEED_SIGNAL (R37.1), 05_RTL8211F (R224.1 R225.1 U2.24)
RST: 10-ESP32 (R313.2), 14-RTL8367 (C334.1 R514.1 U11.91)
SNN_NVHS1_TX1_N: 03-ORIN_HIGH_SPEED_SIGNAL_1 (B1.G34), 06-RTL8111H-1 (C80.1)
SNN_NVHS1_TX1_P: 03-ORIN_HIGH_SPEED_SIGNAL_1 (B1.G35), 06-RTL8111H-1 (C81.1)
SNN_NVHS_SLVS_RX1_N: 03-ORIN_HIGH_SPEED_SIGNAL_1 (B1.B32), 06-RTL8111H-1 (C82.1)
SNN_NVHS_SLVS_RX1_P: 03-ORIN_HIGH_SPEED_SIGNAL_1 (B1.B33), 06-RTL8111H-1 (C83.1)
SNN_NVHS_SLVS_RX5_N: 03-ORIN_HIGH_SPEED_SIGNAL_1 (B1.B36), 06-RTL8111H-1 (R258.2)
SNN_PEX_L4_CLKREQ_N: 04-ORIN_HIGH_SPEED_SIGNAL_2 (B1.G8), 17-INTERFACE (R597.2)
SNN_PEX_L4_RST_N: 04-ORIN_HIGH_SPEED_SIGNAL_2 (B1.J9), 17-INTERFACE (R596.2)
SYS_RST_IN*: 02-ORIN_LOW_SPEED_SIGNAL (B1.L60 C31.2 R59.1 R115.1), 10-ESP32 (R307.1)
UART3_RX_DEBUG: 02-ORIN_LOW_SPEED_SIGNAL (R98.2), 17-INTERFACE (U19.4)
UART3_TX_DEBUG: 02-ORIN_LOW_SPEED_SIGNAL (R97.2), 17-INTERFACE (U19.5)
UPHY_RX6_N: 04-ORIN_HIGH_SPEED_SIGNAL_2 (B1.B17), 17-INTERFACE (J13.8)
UPHY_RX6_P: 04-ORIN_HIGH_SPEED_SIGNAL_2 (B1.B16), 17-INTERFACE (J13.9)
UPHY_RX7_N: 04-ORIN_HIGH_SPEED_SIGNAL_2 (B1.D17), 17-INTERFACE (J13.11)
UPHY_RX7_P: 04-ORIN_HIGH_SPEED_SIGNAL_2 (B1.D16), 17-INTERFACE (J13.12)
UPHY_RX11_N: 04-ORIN_HIGH_SPEED_SIGNAL_2 (B1.D13), 17-INTERFACE (C441.1)
UPHY_RX11_P: 04-ORIN_HIGH_SPEED_SIGNAL_2 (B1.D12), 17-INTERFACE (C440.1)
UPHY_TX11_N: 04-ORIN_HIGH_SPEED_SIGNAL_2 (B1.H13), 17-INTERFACE (C439.1)
UPHY_TX11_P: 04-ORIN_HIGH_SPEED_SIGNAL_2 (B1.H12), 17-INTERFACE (C438.1)
W5500_RX_N: 10-ESP32 (R330.2), 14-RTL8367 (C266.2 R462.2)
W5500_RX_P: 10-ESP32 (R332.2), 14-RTL8367 (C269.2 R465.2)
W5500_TX_N: 10-ESP32 (R327.2), 14-RTL8367 (C270.2 R473.2)
W5500_TX_P: 10-ESP32 (R328.2), 14-RTL8367 (C273.2 R476.2)
WS2812: 10-ESP32 (R312.1), 11-LED (LED12.2)